# EAGLE design xlrpcb (EAGLE 9.6.2)
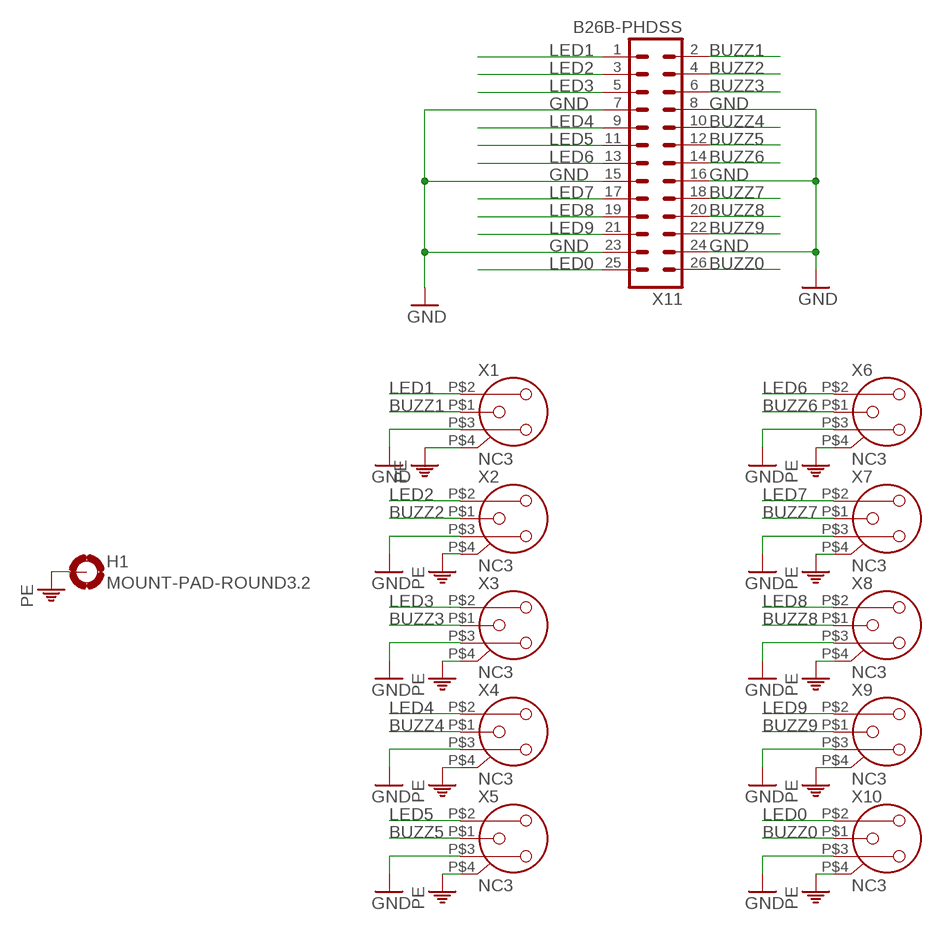
[diagram p0: schematic, sheet 1]

## Parts
H1  MOUNT-PAD-ROUND3.2  [3,2-PAD]
X1  NC3  [NC3FD-X]
X2  NC3  [NC3FD-X]
X3  NC3  [NC3FD-X]
X4  NC3  [NC3FD-X]
X5  NC3  [NC3FD-X]
X6  NC3  [NC3FD-X]
X7  NC3  [NC3FD-X]
X8  NC3  [NC3FD-X]
X9  NC3  [NC3FD-X]
X10  NC3  [NC3FD-X]
X11  B26B-PHDSS  [B26B-PHDSS]

## Nets
BUZZ0: X10.P$1 X11.26
BUZZ1: X1.P$1 X11.2
BUZZ2: X2.P$1 X11.4
BUZZ3: X3.P$1 X11.6
BUZZ4: X4.P$1 X11.10
BUZZ5: X5.P$1 X11.12
BUZZ6: X6.P$1 X11.14
BUZZ7: X7.P$1 X11.18
BUZZ8: X8.P$1 X11.20
BUZZ9: X9.P$1 X11.22
GND: X1.P$3 X2.P$3 X3.P$3 X4.P$3 X5.P$3 X6.P$3 X7.P$3 X8.P$3 X9.P$3 X10.P$3 X11.7 X11.8 X11.15 X11.16 X11.23 X11.24
LED0: X10.P$2 X11.25
LED1: X1.P$2 X11.1
LED2: X2.P$2 X11.3
LED3: X3.P$2 X11.5
LED4: X4.P$2 X11.9
LED5: X5.P$2 X11.11
LED6: X6.P$2 X11.13
LED7: X7.P$2 X11.17
LED8: X8.P$2 X11.19
LED9: X9.P$2 X11.21
PE: H1.B3,2(MOUNT) X1.P$4(G) X2.P$4(G) X3.P$4(G) X4.P$4(G) X5.P$4(G) X6.P$4(G) X7.P$4(G) X8.P$4(G) X9.P$4(G) X10.P$4(G)

## Library data of the parts
H1 = holes:MOUNT-PAD-ROUND: MOUNTING PAD, round
X1-X10 = con-neutrik_ag:NC3: Neutrik Audio Connector XLR SERIES Stereo 1/4" jack Source: www.neutrik.com/
X11 = con-JST PHD:B26B-PHDSS: JST PHD series header 2.00mm pitch disconnectable crimp style connectors, vertical (side entry type), 26 pins

## Board
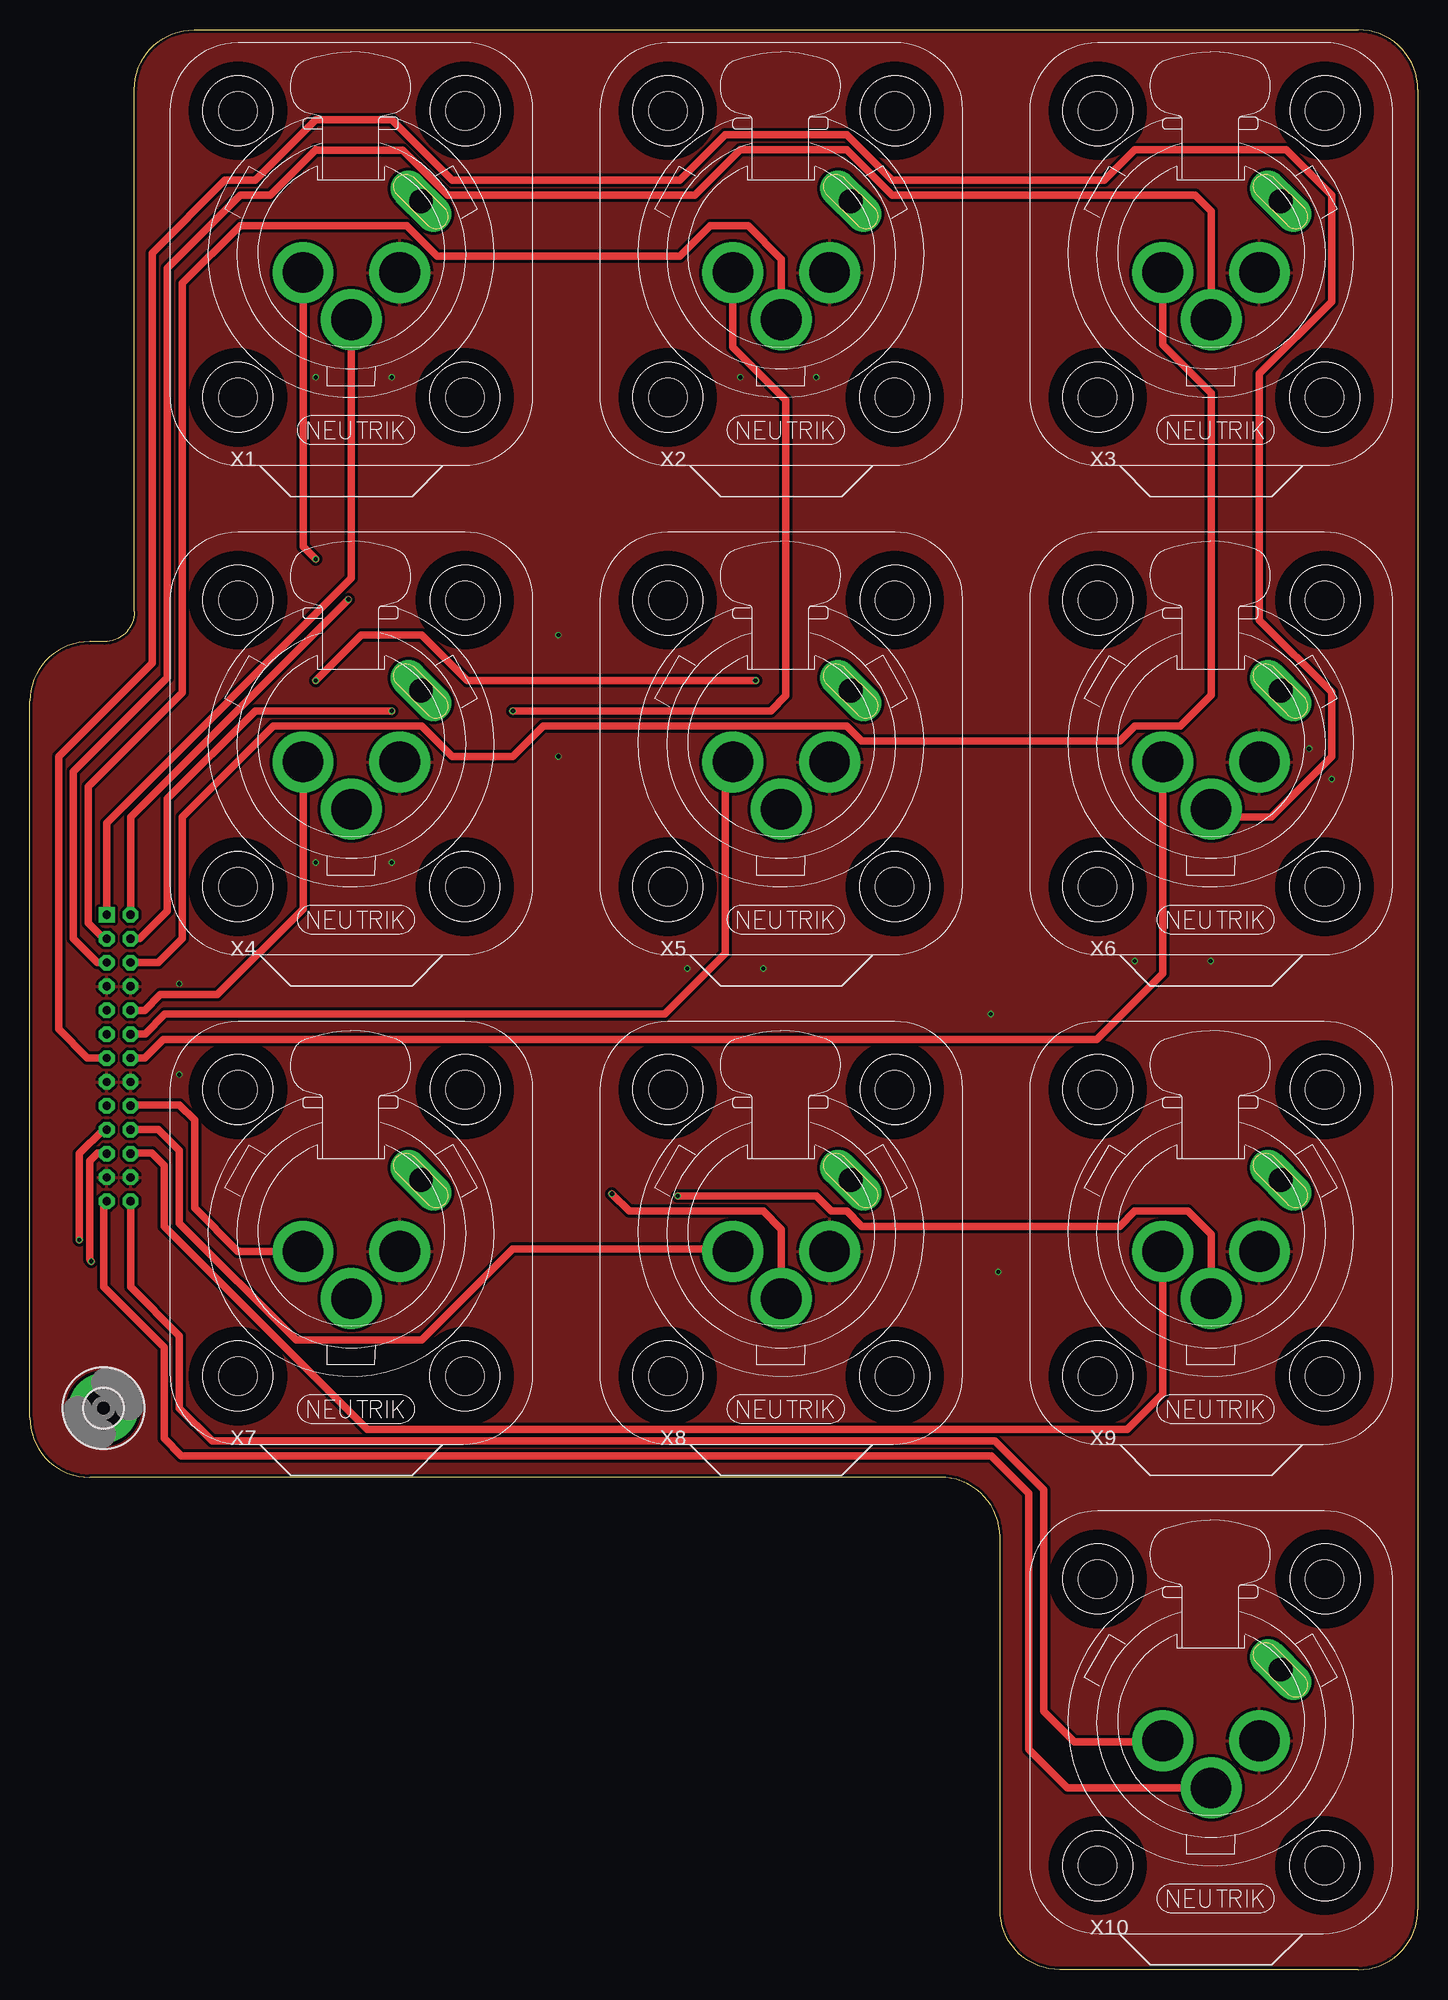
[diagram p1: board, top side]
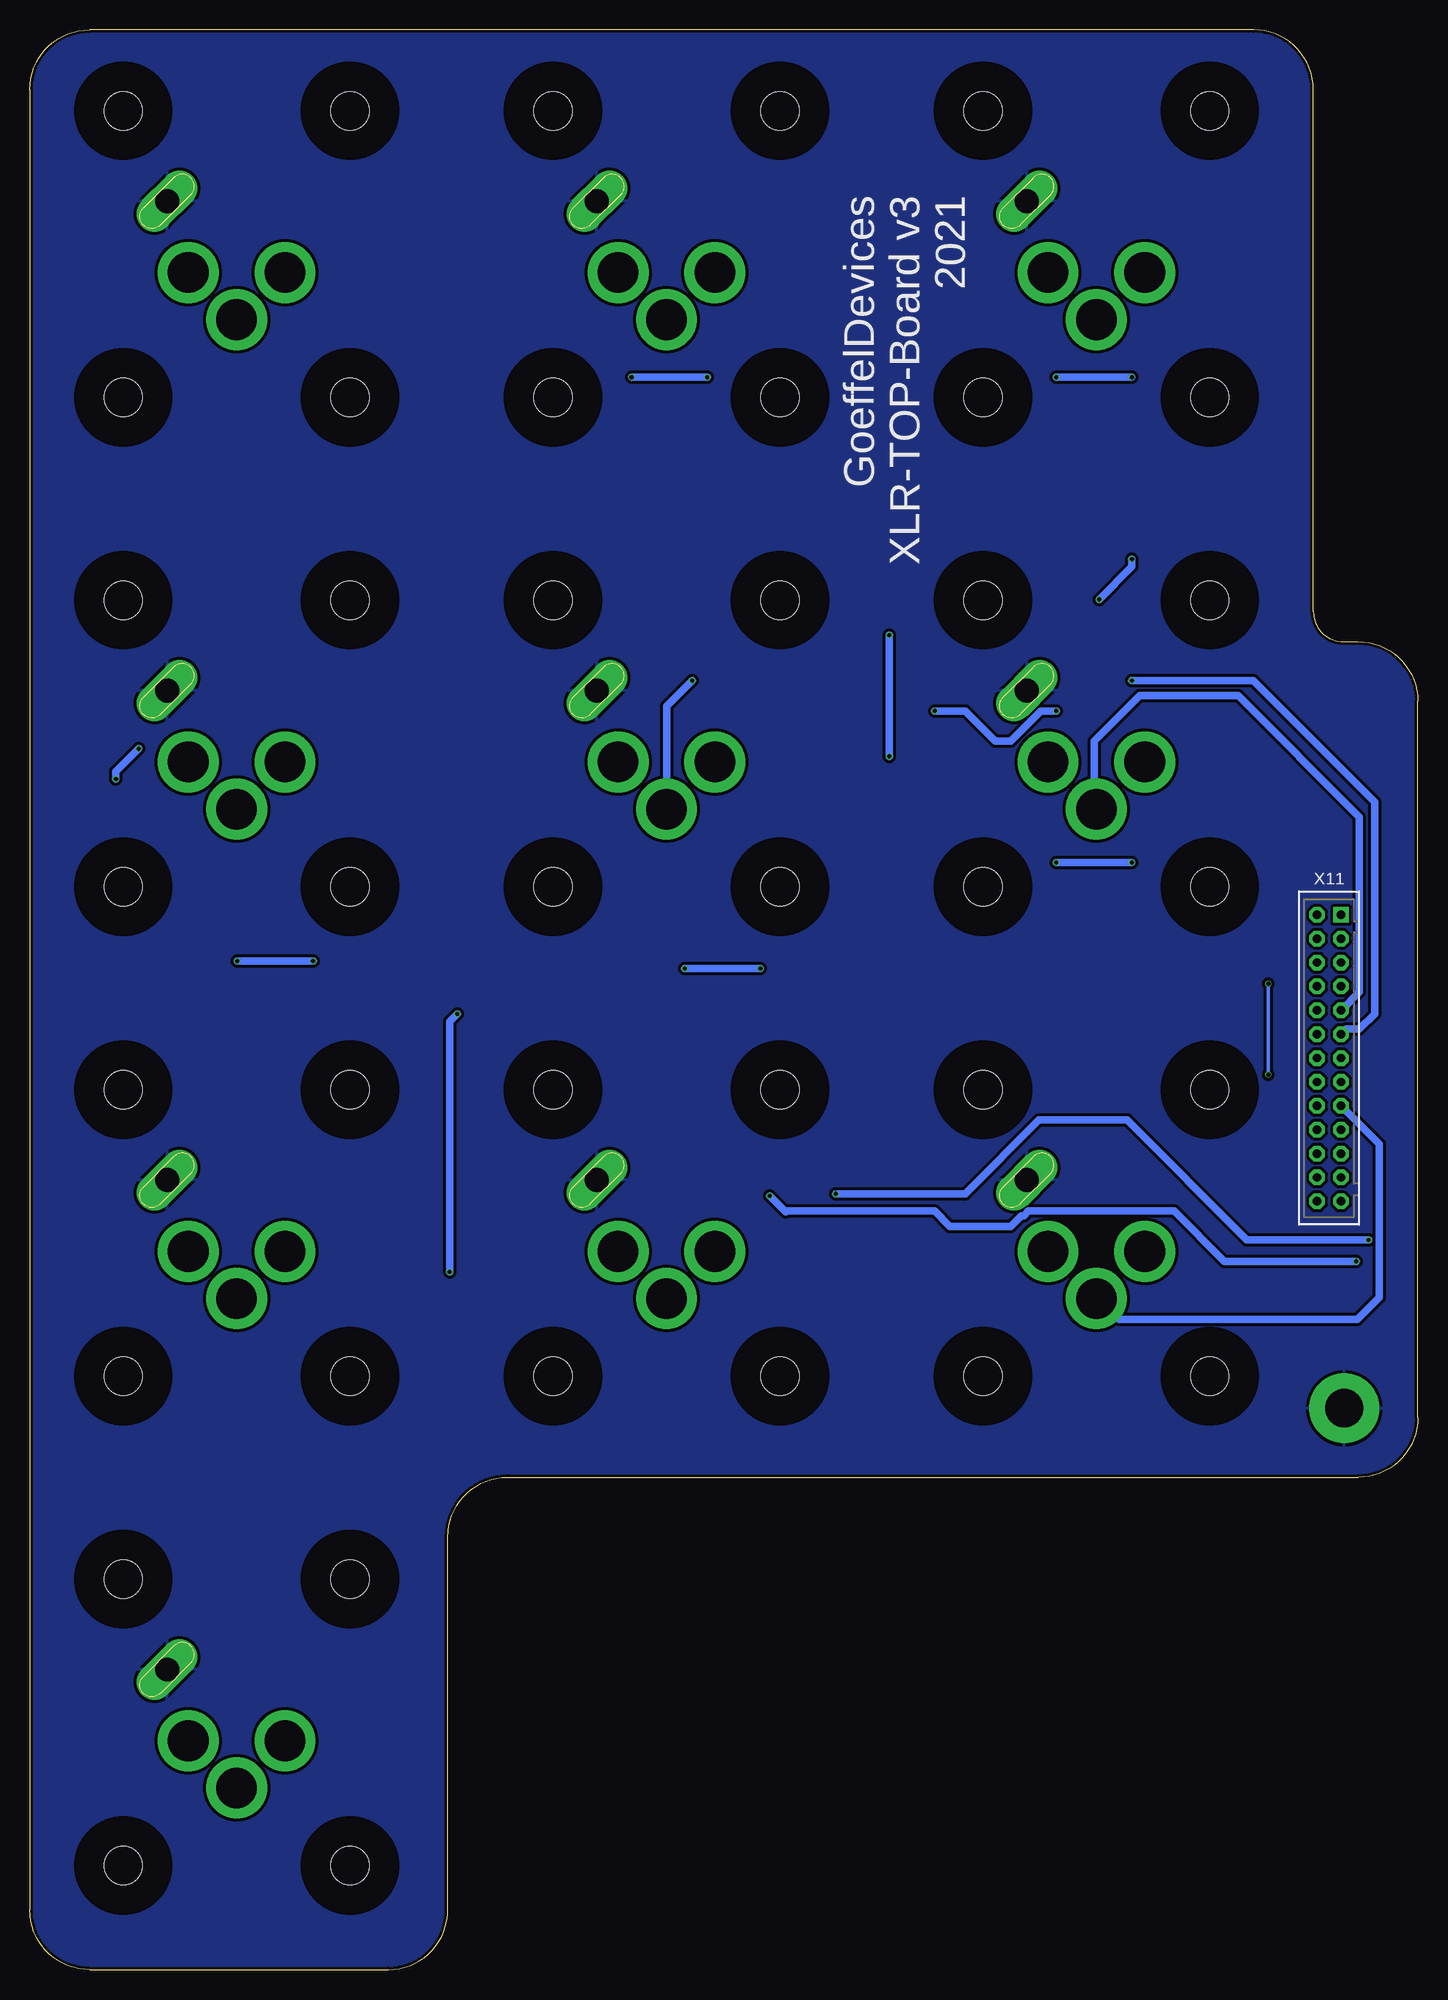
[diagram p2: board, bottom side, seen from below]

Size 116.25 x 162.5 mm. Coordinates in mm from the lower left corner, seen from the top.
Outline: 13.75,162.5 111.25,162.5 arc-90 116.25,157.5 116.25,5 arc-90 111.25,0 86.25,0 arc-90 81.25,5 81.25,36.25 arc90 76.25,41.25 5,41.25 arc-90 0,46.25 0,106.25 arc-90 5,111.25 6.25,111.25 arc90 8.75,113.75 8.75,157.5 arc-90 13.75,162.5
Copper layers (1*16): Top 0.035mm / dielectric 1.6mm / Bottom 0.035mm
Design rules "jlcpcb-2layers *": minimum track width 5mil, minimum drill 0.3mm, track to track 5mil, track to pad 5mil, pad to pad 5mil, via to via 5mil, smd to smd 5mil, copper to edge 0.2mm, drill to drill 6mil, minimum pad ring 10mil, minimum via ring 3mil, stop-mask expansion 4mil, vias tented up to drill 0mil, thermal gap 10mil

### Footprints (pad centres in the part's own frame; a part is rotated, then mirrored left to right if it is on the bottom)
3,2-PAD = drill 3.2 pad 5.842: B3,2 0,0
NC3FD-X = drill 3.4: P$1 -4.05,-1.55; P$2 0,-5.5; P$3 4.05,-1.55 | drill 2 long: P$4 5.828,4.419 | hole 3.2: -9.5,12; 9.5,12; 9.5,-12; -9.5,-12
B26B-PHDSS = drill 0.7 pad 1.3 square: 1 12,-1 | drill 0.7 pad 1.3 octagon: 2 12,1; 3 10,-1; 4 10,1; 5 8,-1; 6 8,1; 7 6,-1; 8 6,1; 9 4,-1; 10 4,1; 11 2,-1; 12 2,1; 13 0,-1; 14 0,1; 15 -2,-1; 16 -2,1; 17 -4,-1; 18 -4,1; 19 -6,-1; 20 -6,1; 21 -8,-1; 22 -8,1; 23 -10,-1; 24 -10,1; 25 -12,-1; 26 -12,1

### Placement (x,y rotation side)
H1  6.17,47.03 0 top
X1  26.93,143.72 0 top
X2  62.93,143.72 0 top
X3  98.93,143.72 0 top
X4  26.93,102.72 0 top
X5  62.93,102.72 0 top
X6  98.93,102.72 0 top
X7  26.93,61.72 0 top
X8  62.93,61.72 0 top
X9  98.93,61.72 0 top
X10  98.93,20.72 0 top
X11  7.44,76.37 90 bottom

### Tracks (layer width: path | path; a pad name or v marks a point on that pad's centre or on a via)
BUZZ0
  Top 0.61: X11.26 8.44,57.19 12.52,53.11 12.52,47.03 15.27,44.28 80.81,44.28 84.91,40.17 84.91,21.63 87.45,19.09 94.8,19.09 X10.P$1
BUZZ1  (via drill 0.35)
  Top 0.61: v26.68,114.78 8.44,96.54 X11.2 | v23.95,118.15 22.88,119.22 X1.P$1
  Bottom 0.61: v26.68,114.78 23.95,117.52 v23.95,118.15
BUZZ2  (via drill 0.35)
  Top 0.61: X11.4 9.19,86.37 11.5,88.69 11.5,98.08 18.87,105.45 v30.3,105.45 | v40.46,105.45 62.05,105.45 63.32,106.72 63.32,131.49 58.88,135.93 X2.P$1
  Bottom 0.61: v30.3,105.45 31.57,105.45 34.11,102.91 35.38,102.91 37.92,105.45 v40.46,105.45
BUZZ3
  Top 0.61: X11.6 10.74,84.37 12.77,86.4 12.77,96.56 20.39,104.18 32.84,104.18 35.38,101.64 40.46,101.64 43,104.18 68.4,104.18 69.67,102.91 91.26,102.91 92.53,104.18 96.34,104.18 98.93,106.77 98.93,132.07 94.88,136.12 X3.P$1
BUZZ4
  Top 0.61: X11.10 9.63,80.37 10.93,81.67 15.7,81.67 22.88,88.86 X4.P$1
BUZZ5
  Top 0.61: X11.12 8.47,78.4 9.66,78.4 11.31,80.05 53.16,80.05 58.24,85.13 58.24,101 58.41,101.17 X5.P$1
BUZZ6
  Top 0.61: X11.14 9.63,76.37 11.17,77.91 89.36,77.91 94.88,83.44 X6.P$1
BUZZ7
  Top 0.61: X11.18 8.5,72.43 12.52,72.43 13.79,71.16 13.79,63.79 17.41,60.17 X7.P$1
BUZZ8
  Top 0.61: X11.20 8.47,70.4 10.74,70.4 12.52,68.62 12.52,62.52 22.3,52.74 32.84,52.74 40.46,60.37 58.69,60.37 X8.P$1
BUZZ9
  Top 0.61: X11.22 8.47,68.4 10.2,68.4 11.25,67.35 11.25,62.27 28.27,45.25 91.89,45.25 94.88,48.24 X9.P$1
GND  (via drill 0.35)
  Bottom 0.305: v12.52,82.59 v12.52,74.97
  Bottom 0.61: v80.47,80.05 81.1,79.42 v81.1,58.46 | v107.14,102.28 109.04,100.37 v109.04,99.73 | v92.53,84.5 v98.88,84.5 | v55.06,83.86 v61.41,83.86 | v23.95,92.75 v30.3,92.75 | v44.27,111.8 v44.27,101.64 | v23.95,133.39 v30.3,133.39 | v59.51,133.39 v65.86,133.39
  pour Top (isolate 0.254): -10.34,165.14 -10.34,-8.85 120.47,-8.85 120.47,165.14
LED0
  Top 0.61: X11.25 6.25,64.18 6.17,64.18 6.17,57.19 11.25,52.11 11.25,44.49 12.68,43.06 80.5,43.06 83.64,39.92 83.64,18.45 86.88,15.22 X10.P$2
LED1
  Top 0.61: X11.1 6.44,96.07 26.93,116.56 X1.P$2
LED2
  Top 0.61: X11.3 6.2,86.37 4.9,87.67 4.9,99.1 12.77,106.97 12.77,141.26 17.6,146.09 31.57,146.09 34.11,143.55 54.43,143.55 56.97,146.09 60.15,146.09 62.93,143.31 X2.P$2
LED3
  Top 0.61: X11.5 5.66,84.37 3.63,86.4 3.63,100.37 11.5,108.24 11.5,142.53 17.6,148.63 20.14,148.63 23.95,152.44 23.99,152.4 31.23,152.4 35,148.63 55.7,148.63 59.51,152.44 68.4,152.44 72.21,148.63 97.61,148.63 98.93,147.31 X3.P$2
LED4
  Bottom 0.61: X11.9 6.42,80.37 4.9,81.89 4.9,96.56 15.06,106.72 23.31,106.72 27.12,102.91 27.12,97.42 X4.P$2
LED5  (via drill 0.35)
  Top 0.61: v60.78,107.99 36.65,107.99 32.84,111.8 27.76,111.8 v23.95,107.99
  Bottom 0.61: v23.95,107.99 13.79,107.99 3.63,97.83 3.63,80.05 4.9,78.78 6.01,78.78 6.42,78.37 X11.11 | v60.78,107.99 62.93,105.84 X5.P$2
LED6
  Top 0.61: X11.13 4.82,76.37 2.41,78.78 2.41,101.64 10.23,109.46 10.23,143.8 16.33,149.9 18.87,149.9 23.95,154.98 30.3,154.98 35.38,149.9 54.43,149.9 58.24,153.71 68.4,153.71 72.21,149.9 89.99,149.9 92.53,152.44 105.23,152.44 109.04,148.63 109.04,139.74 102.98,133.68 102.98,113.07 109.04,107.01 109.04,101.64 103.96,96.56 99.59,96.56 X6.P$2
LED7
  Bottom 0.61: X11.17 3.25,69.18 3.25,56.3 5.09,54.46 25.03,54.46 26.79,56.22 X7.P$2
LED8  (via drill 0.35)
  Top 0.61: v4.13,61.13 4.13,68.36 6.17,70.4 6.41,70.4 X11.19 | v48.75,65 50.21,63.54 61.41,63.54 62.93,62.03 X8.P$2
  Bottom 0.61: v4.13,61.13 14.33,61.13 24.36,71.16 31.76,71.16 37.92,65 v48.75,65
LED9  (via drill 0.35)
  Top 0.61: v5.15,59.35 5.03,59.48 5.03,67.73 5.7,68.4 6.41,68.4 X11.21 | v54.27,64.81 65.86,64.81 67.13,63.54 68.4,63.54 69.67,62.27 91.26,62.27 92.53,63.54 96.97,63.54 98.93,61.58 X9.P$2
  Bottom 0.61: v54.27,64.81 52.95,63.49 52.91,63.54 40.46,63.54 39.19,62.27 34.11,62.27 33.23,63.15 33.02,63.15 32.62,63.54 20.39,63.54 16.2,59.35 v5.15,59.35
PE
  pour Bottom (isolate 0.254): -11.61,169.59 -11.61,-4.41 119.2,-4.41 119.2,169.59

### Text on the board
bNames: 2021 | XLR-TOP-Board v3 | GoeffelDevices